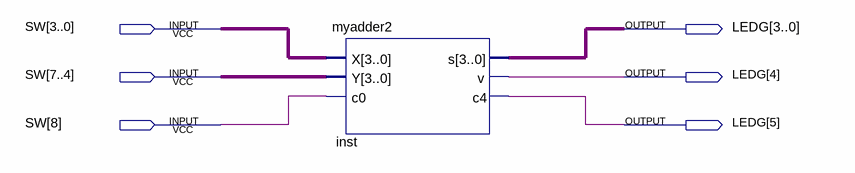
[diagram p0: schematic sheet]
// Quartus schematic Lab5.bdf as structural Verilog: 1 symbols, 6 pins
module Lab5 (
  input  [8:0] SW,
  output [5:0] LEDG
);

  myadder2 inst (.X(SW[3:0]), .Y(SW[7:4]), .c0(SW[8]), .s(LEDG[3:0]), .v(LEDG[4]), .c4(LEDG[5]));
endmodule
